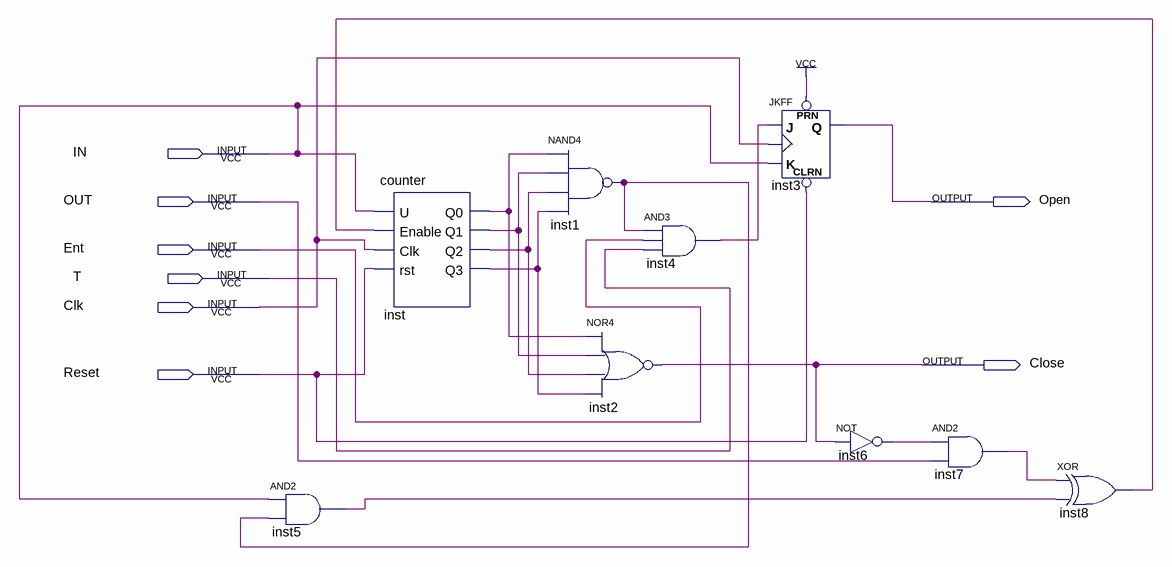
[diagram p0: schematic sheet]
// Quartus schematic az2.bdf as structural Verilog: 9 symbols, 8 pins
module az2 (
  input  IN,
  input  OUT,
  input  Ent,
  input  T,
  input  Clk,
  input  Reset,
  output Open,
  output Close
);

  wire inst1_out, inst4_out, inst5_out, inst6_out, inst7_out, inst8_out, inst_q0, inst_q1, inst_q2, inst_q3;

  and inst5 (inst5_out, IN, inst1_out);
  counter inst (
    .U(IN), .Enable(inst8_out), .Clk(Clk), .rst(Reset), .Q0(inst_q0), .Q1(inst_q1), .Q2(inst_q2), .Q3(inst_q3));
  nand inst1 (inst1_out, inst_q0, inst_q1, inst_q2, inst_q3);
  nor inst2 (Close, inst_q0, inst_q1, inst_q2, inst_q3);
  and inst4 (inst4_out, inst1_out, Ent, T);
  JKFF inst3 (.PRN(1'b1), .CLRN(Reset), .K(IN), .J(inst4_out), .CLK(Clk), .Q(Open));
  not inst6 (inst6_out, Close);
  and inst7 (inst7_out, inst6_out, OUT);
  xor inst8 (inst8_out, inst7_out, inst5_out);
endmodule
